# Altium schematic sheet TheStaticTurtle_oshw-sdi3g-fiber__schematic_V4-Normal_OSHW_BiDi_SDI_Fiber_Converter_V4_Normal_2024-11-17__Diag.schdoc
size 84 x 50 mm
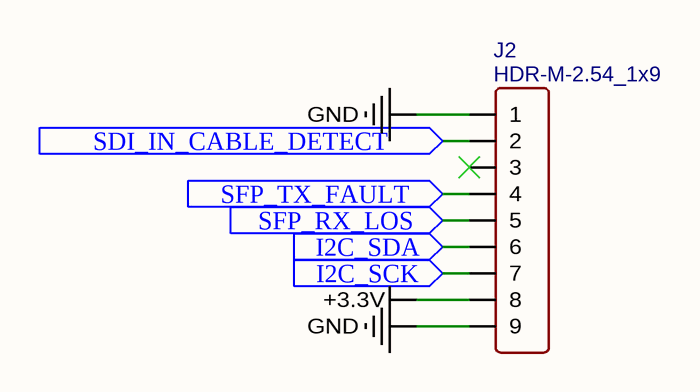
[diagram p0: TheStaticTurtle_oshw-sdi3g-fiber__schematic_V4-Normal_OSHW_BiDi_SDI_Fiber_Converter_V4_Normal_2024-11-17__Diag.schdoc]

## Parts
J2  HDR-M-2.54_1x9  [HDR-M-2.54_1X9]

## Ports
I2C_SCK (in), I2C_SDA (in), SDI_IN_CABLE_DETECT (in), SFP_RX_LOS (in), SFP_TX_FAULT (in)

## Nets
+3.3V: J2.8
GND: J2.1 J2.9
I2C_SCK: J2.7 ; port I2C_SCK
I2C_SDA: J2.6 ; port I2C_SDA
SDI_IN_CABLE_DETECT: J2.2 ; port SDI_IN_CABLE_DETECT
SFP_RX_LOS: J2.5 ; port SFP_RX_LOS
SFP_TX_FAULT: J2.4 ; port SFP_TX_FAULT

Not connected (* = marked no-connect by the designer): J2 3*

## Library data of the parts
J2 = HDR-M-2.54_1x9: Contributor: LCEDA_Lib; Supplier Part: C225484; Supplier: LCSC; spicePre: J; spiceSymbolName: HDR-M-2.54_1x9